# Altium schematic sheet breakout.SchDoc
size A4
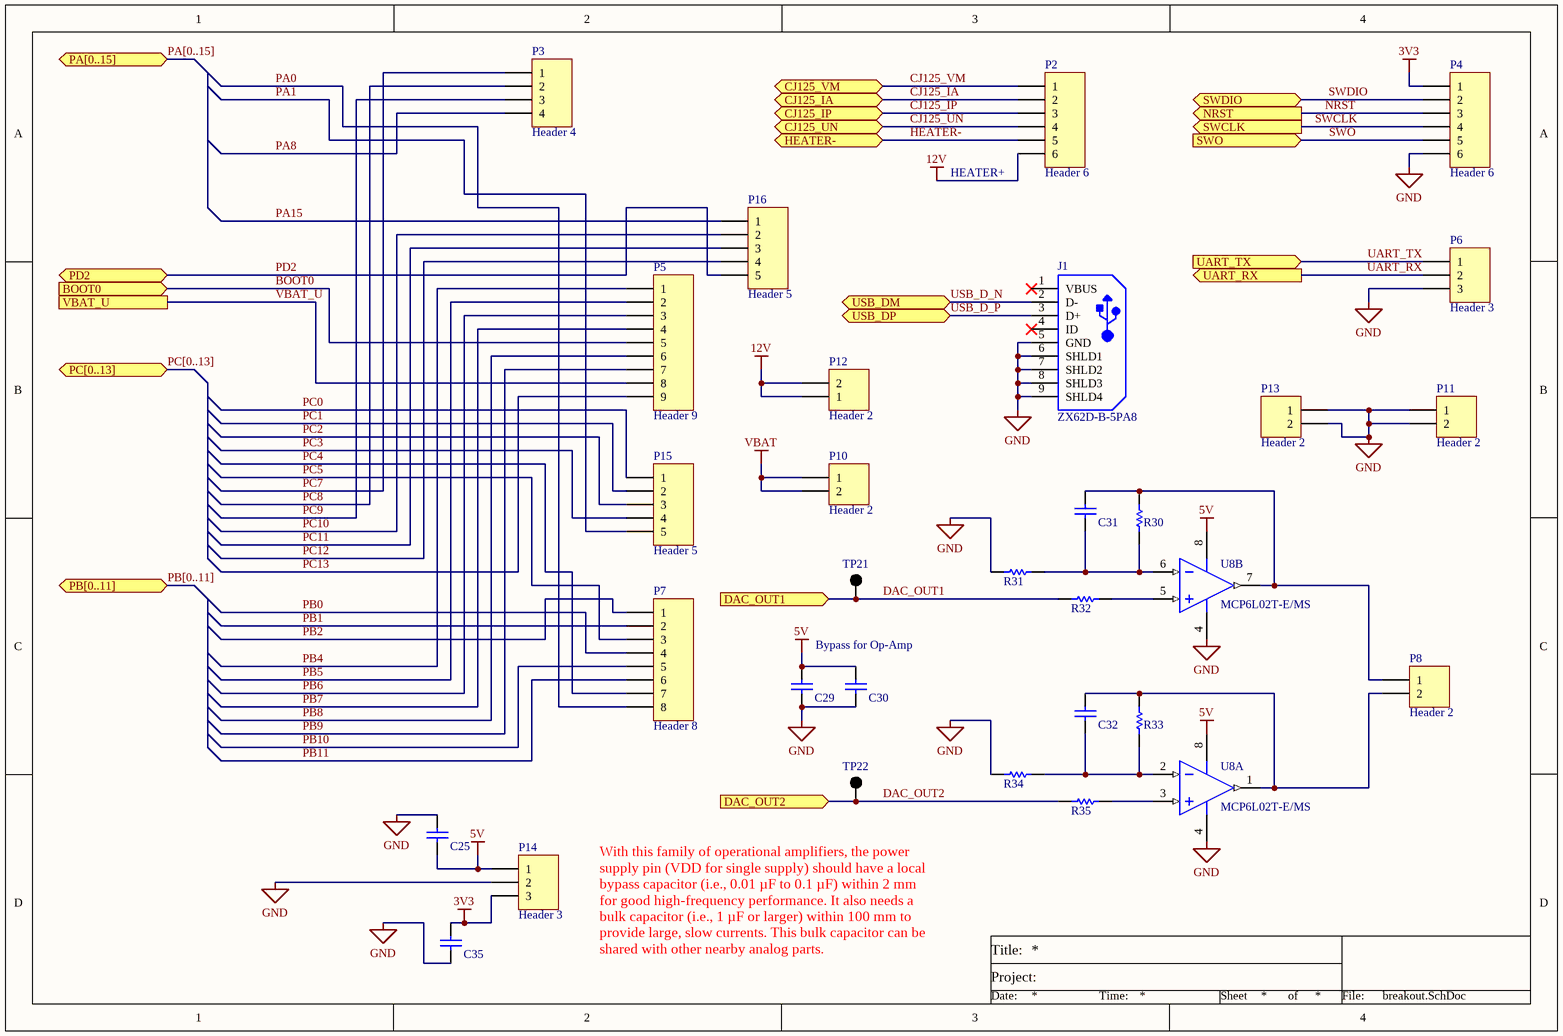
[diagram p0: breakout.SchDoc]

## Parts
C25  Generic 0805 Capacitor  [0805]  (value not drawn)
C29  Generic 0805 Capacitor  [0805]  (value not drawn)
C30  Generic 0805 Capacitor  [0805]  (value not drawn)
C31  Generic 0805 Capacitor  [0805]  (value not drawn)
C32  Generic 0805 Capacitor  [0805]  (value not drawn)
C35  Generic 0805 Capacitor  [0805]  (value not drawn)
J1  ZX62D-B-5PA8  [HIRO-ZX62D-B-5PA8_V]
P2  Header 6  [HDR1X6]
P3  Header 4  [HDR1X4]
P4  Header 6  [HDR1X6]
P5  Header 9  [HDR1X9]
P6  Header 3  [HDR1X3]
P7  Header 8  [HDR1X8]
P8  Header 2  [HDR1X2]
P10  Header 2  [HDR1X2]
P11  Header 2  [HDR1X2]
P12  Header 2  [HDR1X2]
P13  Header 2  [HDR1X2]
P14  Header 3  [HDR1X3]
P15  Header 5  [HDR1X5]
P16  Header 5  [HDR1X5]
R30  Generic 0603 Resistor  [0603]  (value not drawn)
R31  Generic 0603 Resistor  [0603]  (value not drawn)
R32  Generic 0603 Resistor  [0603]  (value not drawn)
R33  Generic 0603 Resistor  [0603]  (value not drawn)
R34  Generic 0603 Resistor  [0603]  (value not drawn)
R35  Generic 0603 Resistor  [0603]  (value not drawn)
TP21  5001  [KSTN-5001]  (value not drawn)
TP22  5001  [KSTN-5001]  (value not drawn)
U8  MCP6L02T-E/MS  [MSOP8_M]  (parts A,B of 2)

## Ports
BOOT0 (in), CJ125_IA (bidir), CJ125_IP (bidir), CJ125_UN (bidir), CJ125_VM (bidir), DAC_OUT1 (in), DAC_OUT2 (in), HEATER- (bidir), NRST (out), PA[0..15] (bidir), PB[0..11] (bidir), PC[0..13] (bidir), PD2 (bidir), SWCLK (out), SWDIO (bidir), SWO (in), UART_RX (out), UART_TX (in), USB_DM (bidir), USB_DP (bidir), VBAT_U

## Nets
3V3: C35.2 P4.1 P14.3
5V: C25.2 C29.2 C30.2 P14.1 U8.8(VDD)
12V: P2.6 P12.1 P12.2
GND: C25.1 C29.1 C30.1 C35.1 J1.5(GND) J1.6(SHLD1) J1.7(SHLD2) J1.8(SHLD3) J1.9(SHLD4) P4.6 P6.3 P11.1 P11.2 P13.1 P13.2 P14.2 R31.1 R34.1 U8.4(VSS)
VBAT: P10.1 P10.2
BOOT0: P5.5 ; port BOOT0
CJ125_IA: P2.2 ; port CJ125_IA
CJ125_IP: P2.3 ; port CJ125_IP
CJ125_UN: P2.4 ; port CJ125_UN
CJ125_VM: P2.1 ; port CJ125_VM
DAC_OUT1: R32.1 TP21.1 ; port DAC_OUT1
DAC_OUT2: R35.1 TP22.1 ; port DAC_OUT2
HEATER-: P2.5 ; port HEATER-
NRST: P4.3 ; port NRST
PA0: P7.8
PA1: P15.5
PA8: P3.4
PA15: P16.1
PB0: P7.4
PB1: P7.2
PB2: P7.1
PB4: P5.1
PB5: P5.2
PB6: P5.3
PB7: P5.4
PB8: P5.6
PB9: P5.7
PB10: P7.5
PB11: P7.6
PC0: P15.1
PC1: P15.2
PC2: P15.3
PC3: P15.4
PC4: P7.7
PC5: P7.3
PC7: P3.1
PC8: P3.2
PC9: P3.3
PC10: P16.2
PC11: P16.3
PC12: P16.4
PC13: P5.9
PD2: P16.5 ; port PD2
SWCLK: P4.4 ; port SWCLK
SWDIO: P4.2 ; port SWDIO
SWO: P4.5 ; port SWO
UART_RX: P6.2 ; port UART_RX
UART_TX: P6.1 ; port UART_TX
USB_D_N: J1.2(D-) ; port USB_DM
USB_D_P: J1.3(D+) ; port USB_DP
VBAT_U: P5.8 ; port VBAT_U
NetC31_1: C31.1 R30.1 R31.2 U8.6(VINB-)
NetC31_2: C31.2 P8.1 R30.2 U8.7(VOUTB)
NetC32_1: C32.1 R33.1 R34.2 U8.2(VINA-)
NetC32_2: C32.2 P8.2 R33.2 U8.1(VOUTA)
NetR32_2: R32.2 U8.5(VINB+)
NetR35_2: R35.2 U8.3(VINA+)

Not connected (* = marked no-connect by the designer): J1 1(VBUS)* 4(ID)*

## Buses and harness runs
bus PA[0..15] = port PA[0..15]
bus PB[0..11] = port PB[0..11]
bus PC[0..13] = port PC[0..13]

## Notes on the sheet
- (near P2) HEATER+
- Bypass for Op-Amp
- With this family of operational amplifiers, the power supply pin (VDD for single supply) should have a local bypass capacitor (i.e., 0.01 µF to 0.1 µF) within 2 mm for good high-frequency performance. It also needs a bulk capacitor (i.e., 1 µF or larger) within 100 mm to provide large, slow currents. This bulk capacitor can be shared with other nearby analog parts.
- Title
- Title:
- Project:
- Size:
- Date:
- File:
- E
- Number:
- Time:
- Revision:
- Sheet
- of

## Library data of the parts
C25 C29-C32 C35 = C_0805: Value: *; Specifications: *
J1 = Micro_USB: Micro-USB Connector Meeting USB 2.0 Standard, -30 to 85 degC, 5-Pin SMD, RoHS, Tape and Reel; Manufacturer: HiroseElectric; Number of Contacts: 5Contact; Current Rating: 1A; Brand: HiroseConnector; Number of Ports: 1Port; Voltage Rating: 30V; Mounting Angle: Right; Gender: Male; Connector Type: Receptacle; RoHS: Details; Package Reference: ZX62D-B-5PA8; Contact Plating: Gold; Product: MicroUSBTypeBConnectors; Shell Plating: Tin; Datasheet Version: 08/2010; Factory Pack Quantity: 2000; Manufacturer URL: https://www.hirose.com; Standard: USB2.0; Datasheet URL: https://datasheet.ciiva.com/22825/0900766b8118f7b1-22825836.pdf; Package Description: 5-Pin Surface Mount Device, Body 7.5 x 5 mm, Pitch 0.65 mm; Operating Temperature Range: -30Cto+85C; Series: ZX; Contact Material: CopperAlloy; Color: Black; Mounting Technology: SurfaceMount; Product Category: USBConnectors; Termination Style: Solder; Packaging: Reel
P2 P4 = Header 6: Header, 6-Pin; LatestRevisionDate: 17-Jul-2002; LatestRevisionNote: Re-released for DXP Platform.; Publisher: Altium Limited
P3 = Header 4: Header, 4-Pin; LatestRevisionDate: 17-Jul-2002; LatestRevisionNote: Re-released for DXP Platform.; Publisher: Altium Limited
P5 = Header 9: Header, 9-Pin; LatestRevisionDate: 17-Jul-2002; LatestRevisionNote: Re-released for DXP Platform.; Publisher: Altium Limited
P6 P14 = Header 3: Header, 3-Pin; LatestRevisionDate: 17-Jul-2002; LatestRevisionNote: Re-released for DXP Platform.; Publisher: Altium Limited
P7 = Header 8: Header, 8-Pin; LatestRevisionDate: 17-Jul-2002; LatestRevisionNote: Re-released for DXP Platform.; Publisher: Altium Limited
P8 P10-P13 = Header 2: Header, 2-Pin; LatestRevisionDate: 17-Jul-2002; LatestRevisionNote: Re-released for DXP Platform.; Publisher: Altium Limited
P15 P16 = Header 5: Header, 5-Pin; LatestRevisionDate: 17-Jul-2002; LatestRevisionNote: Re-released for DXP Platform.; Publisher: Altium Limited
R30-R35 = R_0603: Value: *; Specifications: *
TP21 TP22 = TP5001: Test Point, Black, 1-Pin THD, RoHS, Bulk; Manufacturer: Keystone; Other Names: 5001K; Catalog Drawings: 5000Series; Alternate Color: 5004K-ND / -TESTPOINTPCMINI.040"DYELLOW / 5003K-ND / -TESTPOINTPCMINI.040"DORANGE / 5002K-ND / -TESTPOINTPCMINI.040"DWHITE / 5000K-ND / -TESTPOINTPCMINI.040"DRED; Kits: DKTGRS232C-KIT-ND / -TTLCONVERTER; Online Catalog: ColorCodedTestPoints; Datasheet URL: https://ciiva.com/datasheet-click-2917627?src=ciiva&sig=bd195616; Mounting Type: 0.040"(1.02mm)HoleDiameter; Family: TestPoints; RoHS Information: RoHSComplianceStatement; Datasheet Version: Rev. G, 12/2008; Color: Black; Category: TestandMeasurement; Standard Package: 100; Manufacturer URL: http://www.keyelco.com/; Material: Base,Nylon46,UL94V-0; Type: PCTestPoint,Miniature; Terminal: 0.010"x0.020"(0.25mmx0.51mm)PhosphorBronzeWire,SilverPlated; Series: THM; Packaging: Bulk
U8 = MCP6L02: 1 MHz, 85 Î¼A Dual Op Amp, 8-Pin MSOP, Extended Temperature Range, Tape and Reel; ComponentLink2URL: http://ww1.microchip.com/downloads/en/DeviceDoc/22140b.pdf; PackageDescription: 8-Lead Plastic Micro Small Outline Package (MS) [MSOP]; ComponentLink1URL: http://www.microchip.com/; ComponentLink1Description: Manufacturer URL; RevisionNote: URLs added. DatasheetVersion updated.; PackageVersion: revBB, Aug-2009; ComponentLink3URL: http://www.microchip.com/stellent/groups/techpub_sg/documents/packagingspec/en012702.pdf; ComponentLink2Description: Datasheet; ComponentLink3Description: Package Specification; DatasheetVersion: revB, Sep-2011; PackageReference: MSOP-MS8